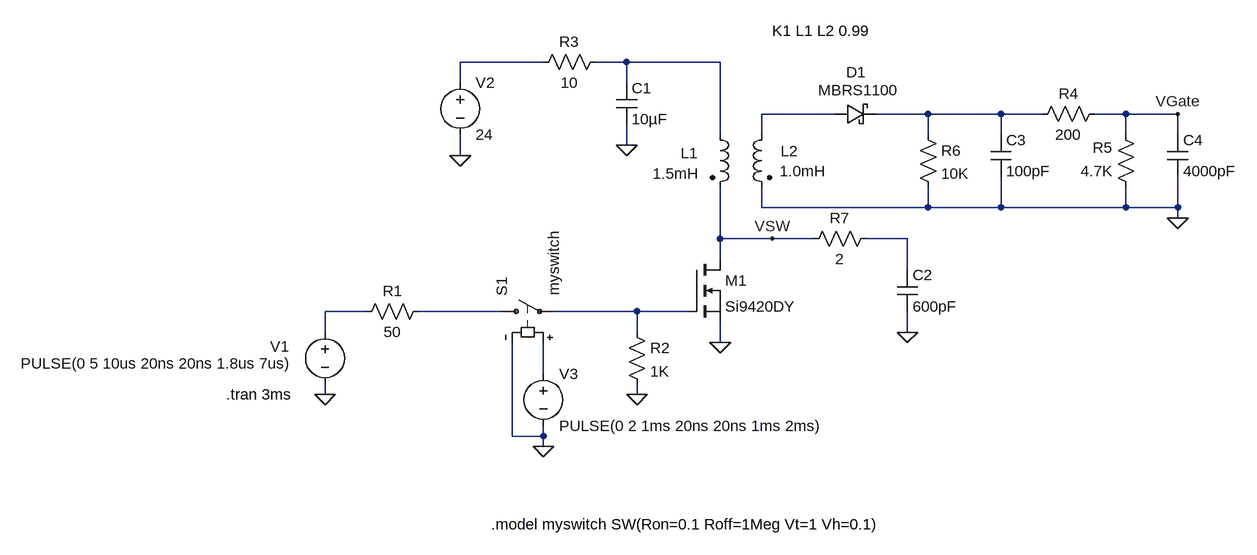
[diagram p0: schematic IGBT Drive2.asc]
IGBT Drive2.asc, the LTspice schematic file:
Version 4
SHEET 1 1236 680
WIRE 160 -224 32 -224
WIRE 288 -224 240 -224
WIRE 432 -224 288 -224
WIRE 32 -192 32 -224
WIRE 288 -192 288 -224
WIRE 608 -144 496 -144
WIRE 752 -144 672 -144
WIRE 864 -144 752 -144
WIRE 928 -144 864 -144
WIRE 1056 -144 1008 -144
WIRE 1136 -144 1056 -144
WIRE 432 -112 432 -224
WIRE 496 -112 496 -144
WIRE 752 -112 752 -144
WIRE 864 -112 864 -144
WIRE 1056 -112 1056 -144
WIRE 1136 -112 1136 -144
WIRE 288 -96 288 -128
WIRE 32 -80 32 -112
WIRE 496 0 496 -32
WIRE 752 0 752 -32
WIRE 752 0 496 0
WIRE 864 0 864 -48
WIRE 864 0 752 0
WIRE 1056 0 1056 -32
WIRE 1056 0 864 0
WIRE 1136 0 1136 -48
WIRE 1136 0 1056 0
WIRE 1136 16 1136 0
WIRE 432 48 432 -32
WIRE 512 48 432 48
WIRE 576 48 512 48
WIRE 720 48 656 48
WIRE 432 80 432 48
WIRE 720 96 720 48
WIRE -112 160 -176 160
WIRE 96 160 -32 160
WIRE 304 160 176 160
WIRE 384 160 304 160
WIRE -176 192 -176 160
WIRE 304 192 304 160
WIRE 720 192 720 160
WIRE 432 208 432 176
WIRE 160 256 160 208
WIRE -176 288 -176 272
WIRE 304 288 304 272
WIRE 112 352 112 208
WIRE 160 352 160 336
WIRE 160 352 112 352
WIRE 160 368 160 352
FLAG -176 288 0
FLAG 432 208 0
FLAG 304 288 0
FLAG 288 -96 0
FLAG 32 -80 0
FLAG 720 192 0
FLAG 1136 16 0
FLAG 1136 -144 VGate
FLAG 512 48 VSW
FLAG 160 368 0
SYMBOL voltage -176 176 R0
WINDOW 0 -84 38 Left 2
WINDOW 3 -468 64 Left 2
WINDOW 123 0 0 Left 0
WINDOW 39 0 0 Left 0
SYMATTR InstName V1
SYMATTR Value PULSE(0 5 10us 20ns 20ns 1.8us 7us)
SYMBOL res -16 144 R90
WINDOW 0 0 56 VBottom 2
WINDOW 3 32 56 VTop 2
SYMATTR InstName R1
SYMATTR Value 50
SYMBOL nmos 384 80 R0
SYMATTR InstName M1
SYMATTR Value Si9420DY
SYMBOL res 288 176 R0
SYMATTR InstName R2
SYMATTR Value 1K
SYMBOL ind2 416 -128 R0
WINDOW 0 -45 44 Left 2
WINDOW 3 -88 76 Left 2
SYMATTR InstName L1
SYMATTR Value 1.5mH
SYMATTR Type ind
SYMBOL ind2 512 -128 M0
WINDOW 0 -40 41 Left 2
WINDOW 3 -83 72 Left 2
SYMATTR InstName L2
SYMATTR Value 1.0mH
SYMATTR Type ind
SYMBOL voltage 32 -208 R0
WINDOW 123 0 0 Left 0
WINDOW 39 0 0 Left 0
SYMATTR InstName V2
SYMATTR Value 24
SYMBOL res 144 -208 R270
WINDOW 0 32 56 VTop 2
WINDOW 3 0 56 VBottom 2
SYMATTR InstName R3
SYMATTR Value 10
SYMBOL cap 272 -192 R0
SYMATTR InstName C1
SYMATTR Value 10µF
SYMBOL cap 704 96 R0
SYMATTR InstName C2
SYMATTR Value 600pF
SYMBOL schottky 608 -128 R270
WINDOW 0 65 33 VTop 2
WINDOW 3 68 36 VBottom 2
SYMATTR InstName D1
SYMATTR Value MBRS1100
SYMATTR Description Diode
SYMATTR Type diode
SYMBOL cap 848 -112 R0
SYMATTR InstName C3
SYMATTR Value 100pF
SYMBOL res 1024 -160 R90
WINDOW 0 0 56 VBottom 2
WINDOW 3 32 56 VTop 2
SYMATTR InstName R4
SYMATTR Value 200
SYMBOL res 1072 -16 R180
WINDOW 0 36 76 Left 2
WINDOW 3 36 40 Left 2
SYMATTR InstName R5
SYMATTR Value 4.7K
SYMBOL cap 1120 -112 R0
SYMATTR InstName C4
SYMATTR Value 4000pF
SYMBOL res 736 -128 R0
SYMATTR InstName R6
SYMATTR Value 10K
SYMBOL voltage 160 240 R0
WINDOW 123 0 0 Left 0
WINDOW 39 0 0 Left 0
SYMATTR InstName V3
SYMATTR Value PULSE(0 2 1ms 20ns 20ns 1ms 2ms)
SYMBOL sw 80 160 R270
SYMATTR InstName S1
SYMATTR Value myswitch
SYMBOL res 672 32 R90
WINDOW 0 0 56 VBottom 2
WINDOW 3 32 56 VTop 2
SYMATTR InstName R7
SYMATTR Value 2
TEXT 512 -272 Left 2 !K1 L1 L2 0.99
TEXT -328 288 Left 2 !.tran 3ms
TEXT 80 488 Left 2 !.model myswitch SW(Ron=0.1 Roff=1Meg Vt=1 Vh=0.1)

The netlist it stands for:
* IGBT Drive2.asc
V1 N006 0 PULSE(0 5 10us 20ns 20ns 1.8us 7us)
R1 N007 N006 50
M1 VSW N008 0 0 Si9420DY
R2 N008 0 1K
L1 N002 VSW 1.5mH
L2 N003 0 1.0mH
V2 N001 0 24
R3 N001 N002 10
C1 N002 0 10µF
C2 N005 0 600pF
D1 N003 N004 MBRS1100
C3 N004 0 100pF
R4 VGate N004 200
R5 0 VGate 4.7K
C4 VGate 0 4000pF
R6 N004 0 10K
V3 N009 0 PULSE(0 2 1ms 20ns 20ns 1ms 2ms)
S1 N007 N008 N009 0 myswitch
R7 N005 VSW 2
.model D D
.lib standard.dio
.model NMOS NMOS
.model PMOS PMOS
.lib standard.mos
K1 L1 L2 0.99
.tran 3ms
.model myswitch SW(Ron=0.1 Roff=1Meg Vt=1 Vh=0.1)
.backanno
.end